# Altium schematic sheet SkayboardRev2.SchDoc
size A0
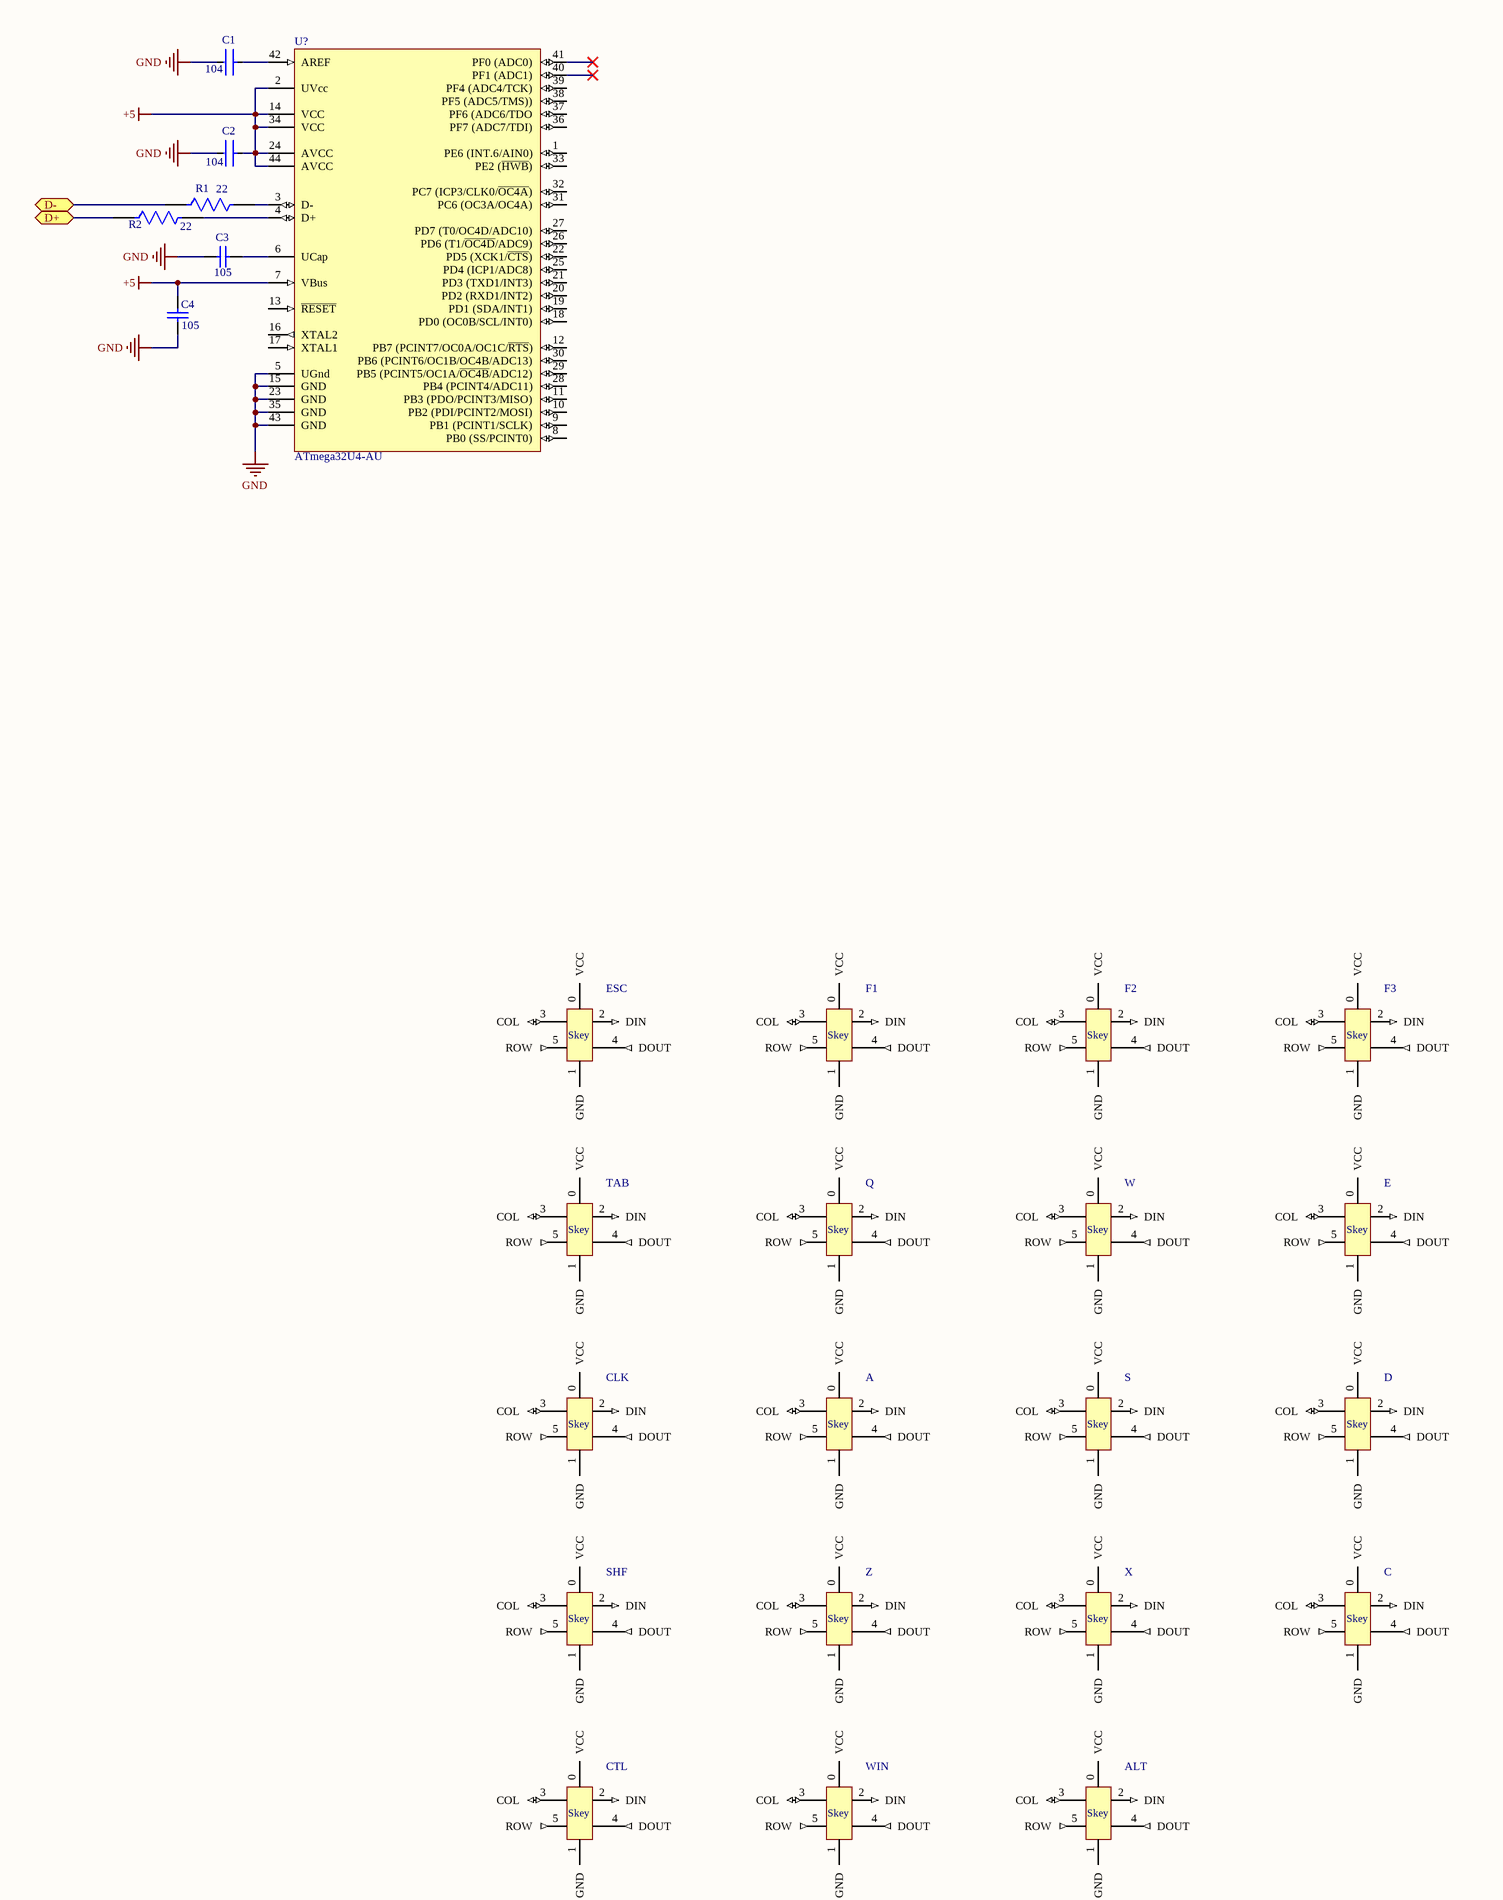
[diagram p0: SkayboardRev2.SchDoc, left]
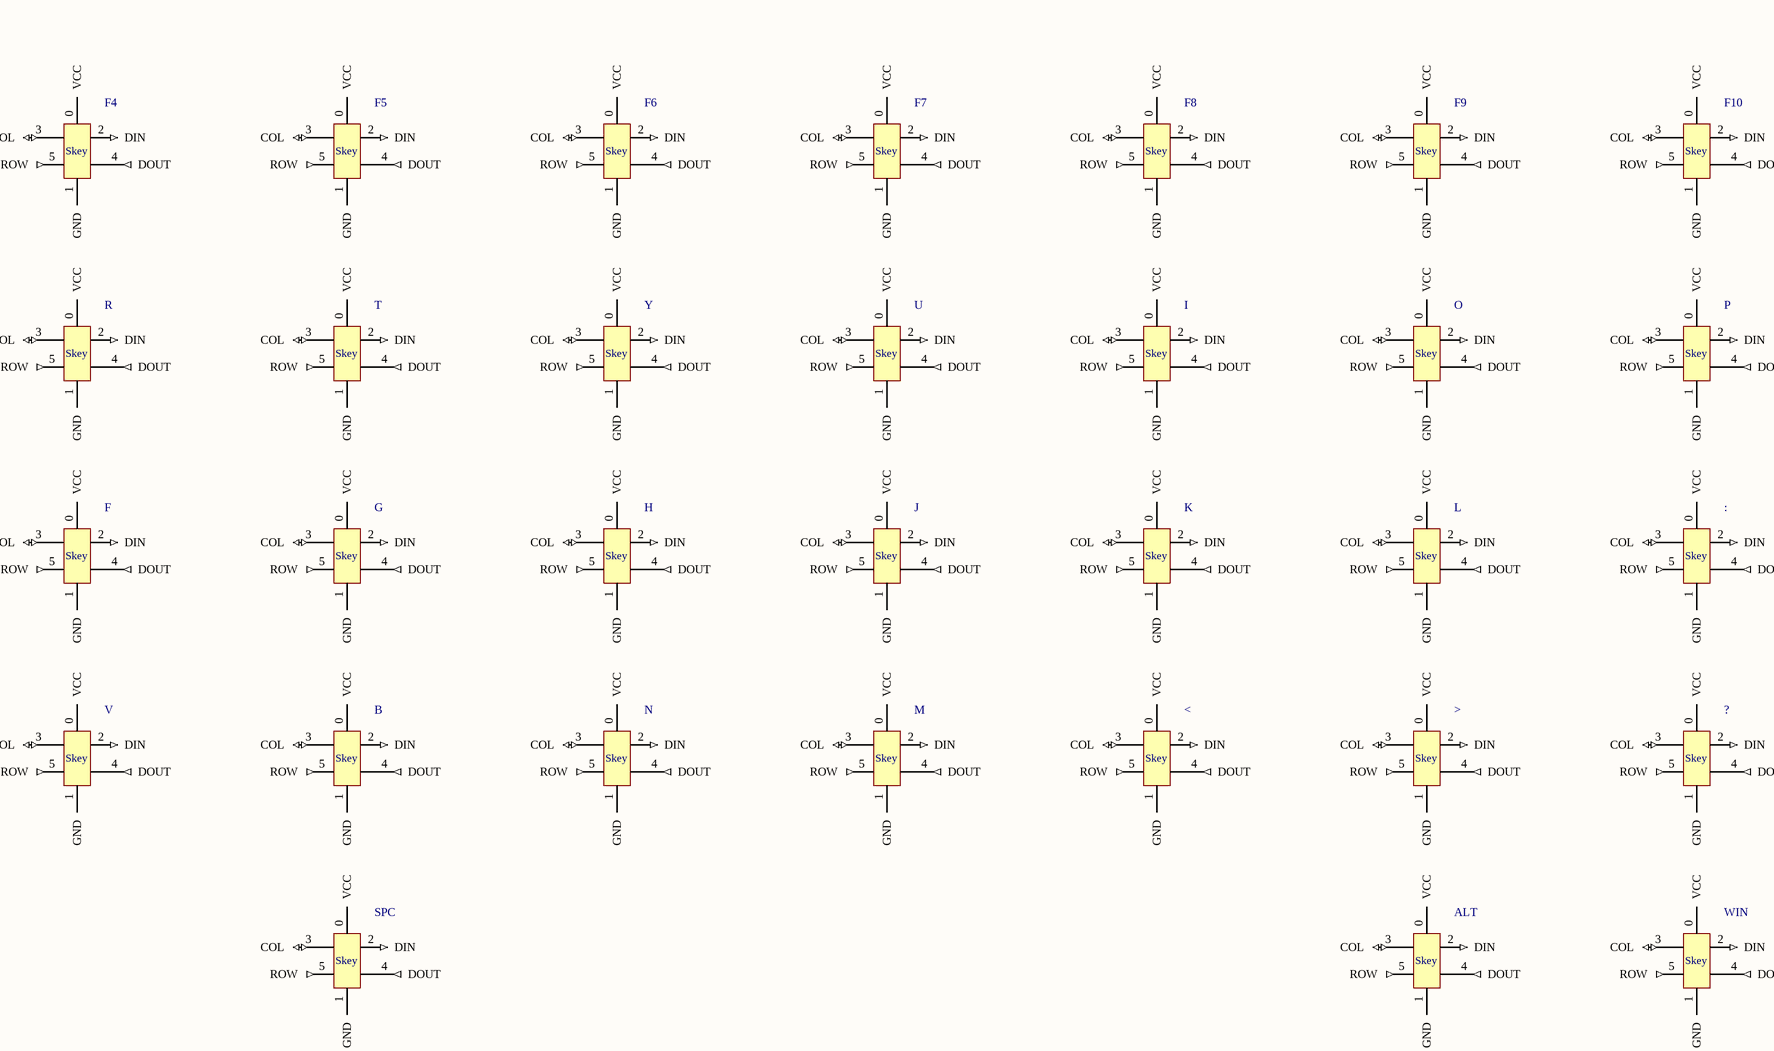
[diagram p1: SkayboardRev2.SchDoc, middle]
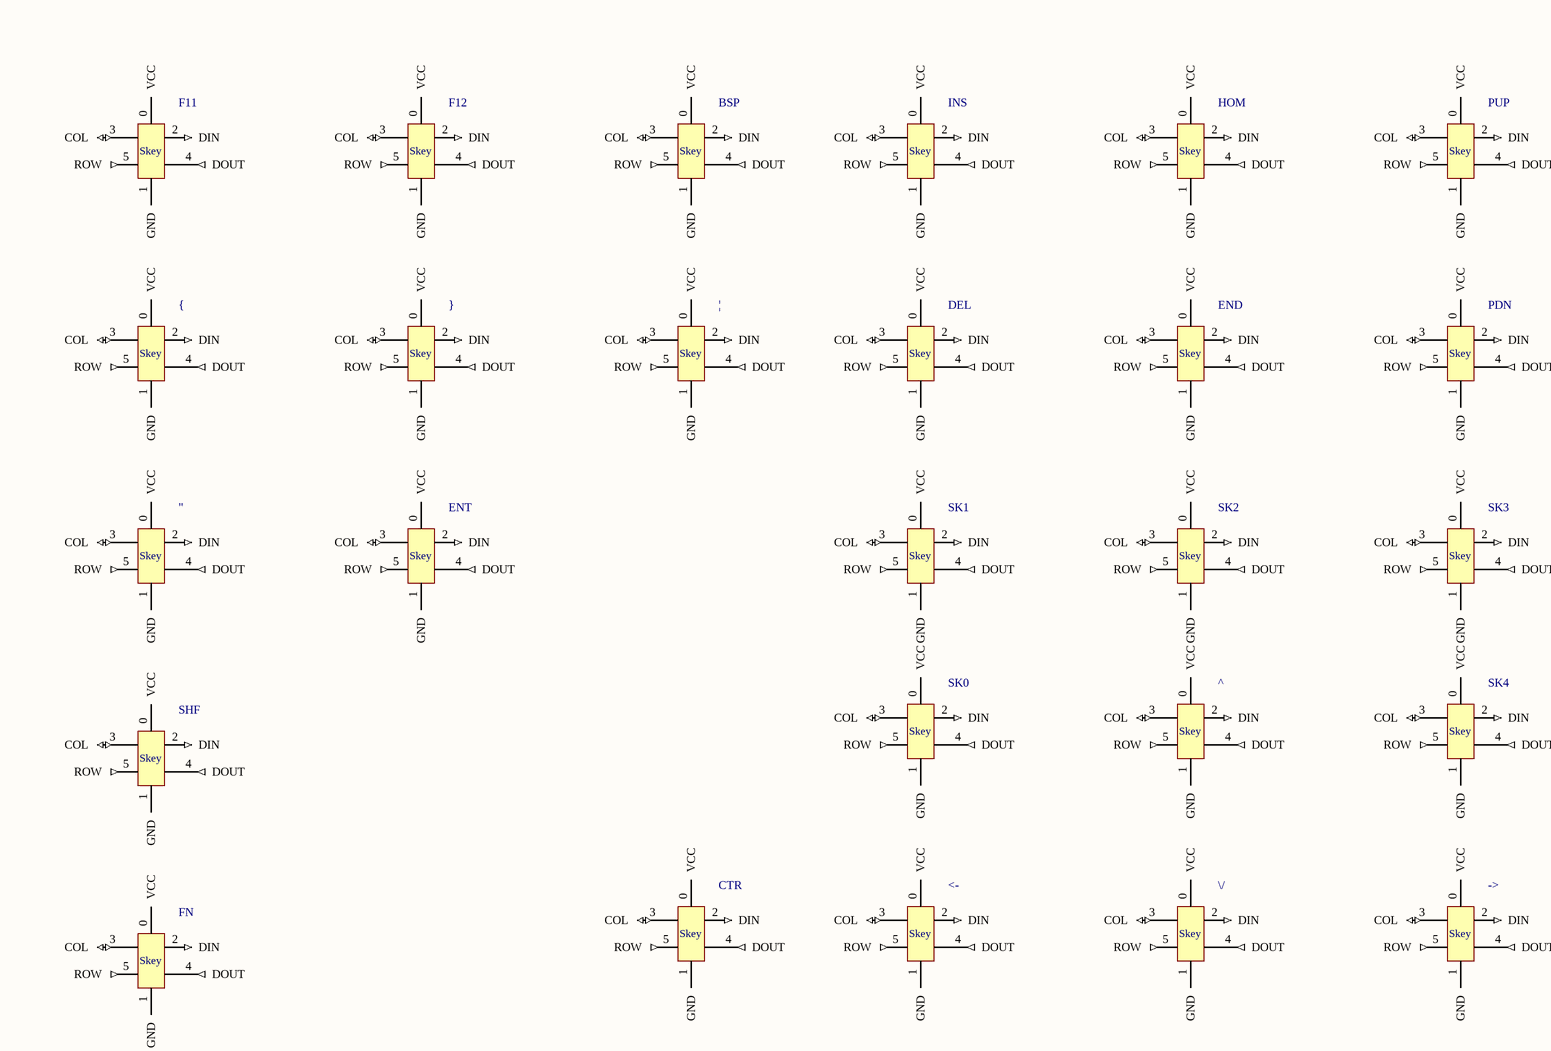
[diagram p2: SkayboardRev2.SchDoc, right]

## Parts
(Parts that share a designator on the sheet are numbered #1, #2 ... from top to bottom, then left to right.)
"  Skey  (value not drawn)  (mechanical)
->  Skey  (value not drawn)  (mechanical)
:  Skey  (value not drawn)  (mechanical)
<  Skey  (value not drawn)  (mechanical)
<-  Skey  (value not drawn)  (mechanical)
>  Skey  (value not drawn)  (mechanical)
?  Skey  (value not drawn)  (mechanical)
\/  Skey  (value not drawn)  (mechanical)
^  Skey  (value not drawn)  (mechanical)
A  Skey  (value not drawn)  (mechanical)
ALT#1  Skey  (value not drawn)  (mechanical)
ALT#2  Skey  (value not drawn)  (mechanical)
B  Skey  (value not drawn)  (mechanical)
BSP  Skey  (value not drawn)  (mechanical)
C  Skey  (value not drawn)  (mechanical)
C1  104  [FP-CGA3E-0_3-0_1-IPC_C]
C2  104  [FP-CGA3E-0_3-0_1-IPC_C]
C3  105  [CAPC1608X90X35LL10T15]
C4  105  [CAPC1608X90X35LL10T15]
CLK  Skey  (value not drawn)  (mechanical)
CTL  Skey  (value not drawn)  (mechanical)
CTR  Skey  (value not drawn)  (mechanical)
D  Skey  (value not drawn)  (mechanical)
DEL  Skey  (value not drawn)  (mechanical)
E  Skey  (value not drawn)  (mechanical)
END  Skey  (value not drawn)  (mechanical)
ENT  Skey  (value not drawn)  (mechanical)
ESC  Skey  (value not drawn)  (mechanical)
F  Skey  (value not drawn)  (mechanical)
F1  Skey  (value not drawn)  (mechanical)
F2  Skey  (value not drawn)  (mechanical)
F3  Skey  (value not drawn)  (mechanical)
F4  Skey  (value not drawn)  (mechanical)
F5  Skey  (value not drawn)  (mechanical)
F6  Skey  (value not drawn)  (mechanical)
F7  Skey  (value not drawn)  (mechanical)
F8  Skey  (value not drawn)  (mechanical)
F9  Skey  (value not drawn)  (mechanical)
F10  Skey  (value not drawn)  (mechanical)
F11  Skey  (value not drawn)  (mechanical)
F12  Skey  (value not drawn)  (mechanical)
FN  Skey  (value not drawn)  (mechanical)
G  Skey  (value not drawn)  (mechanical)
H  Skey  (value not drawn)  (mechanical)
HOM  Skey  (value not drawn)  (mechanical)
I  Skey  (value not drawn)  (mechanical)
INS  Skey  (value not drawn)  (mechanical)
J  Skey  (value not drawn)  (mechanical)
K  Skey  (value not drawn)  (mechanical)
L  Skey  (value not drawn)  (mechanical)
M  Skey  (value not drawn)  (mechanical)
N  Skey  (value not drawn)  (mechanical)
O  Skey  (value not drawn)  (mechanical)
P  Skey  (value not drawn)  (mechanical)
PDN  Skey  (value not drawn)  (mechanical)
PUP  Skey  (value not drawn)  (mechanical)
Q  Skey  (value not drawn)  (mechanical)
R  Skey  (value not drawn)  (mechanical)
R1  22  [FP-CRCW0603-HPe3-IPC_A]
R2  22  [FP-CRCW0603-HPe3-IPC_A]
S  Skey  (value not drawn)  (mechanical)
SHF#1  Skey  (value not drawn)  (mechanical)
SHF#2  Skey  (value not drawn)  (mechanical)
SK0  Skey  (value not drawn)  (mechanical)
SK1  Skey  (value not drawn)  (mechanical)
SK2  Skey  (value not drawn)  (mechanical)
SK3  Skey  (value not drawn)  (mechanical)
SK4  Skey  (value not drawn)  (mechanical)
SPC  Skey  (value not drawn)  (mechanical)
T  Skey  (value not drawn)  (mechanical)
TAB  Skey  (value not drawn)  (mechanical)
U  Skey  (value not drawn)  (mechanical)
U?  ATmega32U4-AU  [44ML_M]
V  Skey  (value not drawn)  (mechanical)
W  Skey  (value not drawn)  (mechanical)
WIN#1  Skey  (value not drawn)  (mechanical)
WIN#2  Skey  (value not drawn)  (mechanical)
X  Skey  (value not drawn)  (mechanical)
Y  Skey  (value not drawn)  (mechanical)
Z  Skey  (value not drawn)  (mechanical)
{  Skey  (value not drawn)  (mechanical)
}  Skey  (value not drawn)  (mechanical)
|  Skey  (value not drawn)  (mechanical)

## Ports
D+ (bidir), D- (bidir)

## Nets
+5: C2.1 C4.2 U?.2(UVcc) U?.7(VBus) U?.14(VCC) U?.24(AVCC) U?.34(VCC) U?.44(AVCC)
GND: C1.2 C2.2 C3.1 C4.1 U?.5(UGnd) U?.15(GND) U?.23(GND) U?.35(GND) U?.43(GND)
D+: R2.1 ; port D+
D-: R1.1 ; port D-
NetC1_1: C1.1 U?.42(AREF)
NetC3_2: C3.2 U?.6(UCap)
NetR1_2: R1.2 U?.3(D-)
NetR2_2: R2.2 U?.4(D+)

Not connected (* = marked no-connect by the designer): " 0(VCC) 1(GND) 2(DIN) 3(COL) 4(DOUT) 5(ROW); -> 0(VCC) 1(GND) 2(DIN) 3(COL) 4(DOUT) 5(ROW); : 0(VCC) 1(GND) 2(DIN) 3(COL) 4(DOUT) 5(ROW); < 0(VCC) 1(GND) 2(DIN) 3(COL) 4(DOUT) 5(ROW); <- 0(VCC) 1(GND) 2(DIN) 3(COL) 4(DOUT) 5(ROW); > 0(VCC) 1(GND) 2(DIN) 3(COL) 4(DOUT) 5(ROW); ? 0(VCC) 1(GND) 2(DIN) 3(COL) 4(DOUT) 5(ROW); \/ 0(VCC) 1(GND) 2(DIN) 3(COL) 4(DOUT) 5(ROW); ^ 0(VCC) 1(GND) 2(DIN) 3(COL) 4(DOUT) 5(ROW); A 0(VCC) 1(GND) 2(DIN) 3(COL) 4(DOUT) 5(ROW); ALT#1 0(VCC) 1(GND) 2(DIN) 3(COL) 4(DOUT) 5(ROW); ALT#2 0(VCC) 1(GND) 2(DIN) 3(COL) 4(DOUT) 5(ROW); B 0(VCC) 1(GND) 2(DIN) 3(COL) 4(DOUT) 5(ROW); BSP 0(VCC) 1(GND) 2(DIN) 3(COL) 4(DOUT) 5(ROW); C 0(VCC) 1(GND) 2(DIN) 3(COL) 4(DOUT) 5(ROW); CLK 0(VCC) 1(GND) 2(DIN) 3(COL) 4(DOUT) 5(ROW); CTL 0(VCC) 1(GND) 2(DIN) 3(COL) 4(DOUT) 5(ROW); CTR 0(VCC) 1(GND) 2(DIN) 3(COL) 4(DOUT) 5(ROW); D 0(VCC) 1(GND) 2(DIN) 3(COL) 4(DOUT) 5(ROW); DEL 0(VCC) 1(GND) 2(DIN) 3(COL) 4(DOUT) 5(ROW); E 0(VCC) 1(GND) 2(DIN) 3(COL) 4(DOUT) 5(ROW); END 0(VCC) 1(GND) 2(DIN) 3(COL) 4(DOUT) 5(ROW); ENT 0(VCC) 1(GND) 2(DIN) 3(COL) 4(DOUT) 5(ROW); ESC 0(VCC) 1(GND) 2(DIN) 3(COL) 4(DOUT) 5(ROW); F 0(VCC) 1(GND) 2(DIN) 3(COL) 4(DOUT) 5(ROW); F1 0(VCC) 1(GND) 2(DIN) 3(COL) 4(DOUT) 5(ROW); F2 0(VCC) 1(GND) 2(DIN) 3(COL) 4(DOUT) 5(ROW); F3 0(VCC) 1(GND) 2(DIN) 3(COL) 4(DOUT) 5(ROW); F4 0(VCC) 1(GND) 2(DIN) 3(COL) 4(DOUT) 5(ROW); F5 0(VCC) 1(GND) 2(DIN) 3(COL) 4(DOUT) 5(ROW); F6 0(VCC) 1(GND) 2(DIN) 3(COL) 4(DOUT) 5(ROW); F7 0(VCC) 1(GND) 2(DIN) 3(COL) 4(DOUT) 5(ROW); F8 0(VCC) 1(GND) 2(DIN) 3(COL) 4(DOUT) 5(ROW); F9 0(VCC) 1(GND) 2(DIN) 3(COL) 4(DOUT) 5(ROW); F10 0(VCC) 1(GND) 2(DIN) 3(COL) 4(DOUT) 5(ROW); F11 0(VCC) 1(GND) 2(DIN) 3(COL) 4(DOUT) 5(ROW); F12 0(VCC) 1(GND) 2(DIN) 3(COL) 4(DOUT) 5(ROW); FN 0(VCC) 1(GND) 2(DIN) 3(COL) 4(DOUT) 5(ROW); G 0(VCC) 1(GND) 2(DIN) 3(COL) 4(DOUT) 5(ROW); H 0(VCC) 1(GND) 2(DIN) 3(COL) 4(DOUT) 5(ROW); HOM 0(VCC) 1(GND) 2(DIN) 3(COL) 4(DOUT) 5(ROW); I 0(VCC) 1(GND) 2(DIN) 3(COL) 4(DOUT) 5(ROW); INS 0(VCC) 1(GND) 2(DIN) 3(COL) 4(DOUT) 5(ROW); J 0(VCC) 1(GND) 2(DIN) 3(COL) 4(DOUT) 5(ROW); K 0(VCC) 1(GND) 2(DIN) 3(COL) 4(DOUT) 5(ROW); L 0(VCC) 1(GND) 2(DIN) 3(COL) 4(DOUT) 5(ROW); M 0(VCC) 1(GND) 2(DIN) 3(COL) 4(DOUT) 5(ROW); N 0(VCC) 1(GND) 2(DIN) 3(COL) 4(DOUT) 5(ROW); O 0(VCC) 1(GND) 2(DIN) 3(COL) 4(DOUT) 5(ROW); P 0(VCC) 1(GND) 2(DIN) 3(COL) 4(DOUT) 5(ROW); PDN 0(VCC) 1(GND) 2(DIN) 3(COL) 4(DOUT) 5(ROW); PUP 0(VCC) 1(GND) 2(DIN) 3(COL) 4(DOUT) 5(ROW); Q 0(VCC) 1(GND) 2(DIN) 3(COL) 4(DOUT) 5(ROW); R 0(VCC) 1(GND) 2(DIN) 3(COL) 4(DOUT) 5(ROW); S 0(VCC) 1(GND) 2(DIN) 3(COL) 4(DOUT) 5(ROW); SHF#1 0(VCC) 1(GND) 2(DIN) 3(COL) 4(DOUT) 5(ROW); SHF#2 0(VCC) 1(GND) 2(DIN) 3(COL) 4(DOUT) 5(ROW); SK0 0(VCC) 1(GND) 2(DIN) 3(COL) 4(DOUT) 5(ROW); SK1 0(VCC) 1(GND) 2(DIN) 3(COL) 4(DOUT) 5(ROW); SK2 0(VCC) 1(GND) 2(DIN) 3(COL) 4(DOUT) 5(ROW); SK3 0(VCC) 1(GND) 2(DIN) 3(COL) 4(DOUT) 5(ROW); SK4 0(VCC) 1(GND) 2(DIN) 3(COL) 4(DOUT) 5(ROW); SPC 0(VCC) 1(GND) 2(DIN) 3(COL) 4(DOUT) 5(ROW); T 0(VCC) 1(GND) 2(DIN) 3(COL) 4(DOUT) 5(ROW); TAB 0(VCC) 1(GND) 2(DIN) 3(COL) 4(DOUT) 5(ROW); U 0(VCC) 1(GND) 2(DIN) 3(COL) 4(DOUT) 5(ROW); U? 1(PE6_(INT.6/AIN0)) 8(PB0_(SS/PCINT0)) 9(PB1_(PCINT1/SCLK)) 10(PB2_(PDI/PCINT2/MOSI)) 11(PB3_(PDO/PCINT3/MISO)) 12(PB7_(PCINT7/OC0A/OC1C/~{RTS})) 13(~{RESET}) 16(XTAL2) 17(XTAL1) 18(PD0_(OC0B/SCL/INT0)) 19(PD1_(SDA/INT1)) 20(PD2_(RXD1/INT2)) 21(PD3_(TXD1/INT3)) 22(PD5_(XCK1/~{CTS})) 25(PD4_(ICP1/ADC8)) 26(PD6_(T1/~{OC4D}/ADC9)) 27(PD7_(T0/OC4D/ADC10)) 28(PB4_(PCINT4/ADC11)) 29(PB5_(PCINT5/OC1A/~{OC4B}/ADC12)) 30(PB6_(PCINT6/OC1B/OC4B/ADC13)) 31(PC6_(OC3A/OC4A)) 32(PC7_(ICP3/CLK0/~{OC4A})) 33(PE2_(~{HWB})) 36(PF7_(ADC7/TDI)) 37(PF6_(ADC6/TDO) 38(PF5_(ADC5/TMS))) 39(PF4_(ADC4/TCK)) 40(PF1_(ADC1))* 41(PF0_(ADC0))*; V 0(VCC) 1(GND) 2(DIN) 3(COL) 4(DOUT) 5(ROW); W 0(VCC) 1(GND) 2(DIN) 3(COL) 4(DOUT) 5(ROW); WIN#1 0(VCC) 1(GND) 2(DIN) 3(COL) 4(DOUT) 5(ROW); WIN#2 0(VCC) 1(GND) 2(DIN) 3(COL) 4(DOUT) 5(ROW); X 0(VCC) 1(GND) 2(DIN) 3(COL) 4(DOUT) 5(ROW); Y 0(VCC) 1(GND) 2(DIN) 3(COL) 4(DOUT) 5(ROW); Z 0(VCC) 1(GND) 2(DIN) 3(COL) 4(DOUT) 5(ROW); { 0(VCC) 1(GND) 2(DIN) 3(COL) 4(DOUT) 5(ROW); } 0(VCC) 1(GND) 2(DIN) 3(COL) 4(DOUT) 5(ROW); | 0(VCC) 1(GND) 2(DIN) 3(COL) 4(DOUT) 5(ROW)

## Notes on the sheet
- Title
- Size:
- Date:
- File:
- A0
- Number:
- Time:
- Revision:
- Sheet
- of

## Library data of the parts
" -> : < <- > ? \/ ^ A ALT#1 ALT#2 B BSP C CLK CTL CTR D DEL E END ENT ESC F F1-F12 FN G H HOM I INS J K L M N O P PDN PUP Q R S SHF#1 SHF#2 SK0-SK4 SPC T TAB U V W WIN#1 WIN#2 X Y Z { } | = Skey: Skey's Symbol
C1 C2 = CMP-08246-000204-1: Cap Ceramic 2.2nF 100V X7R 10% Pad SMD 0603 +125°C Automotive T/R; Termination: SMD/SMT; Min Operating Temperature: -55°C; Lead Free: Lead Free; Composition: Ceramic; Voltage Rating (DC): 100V; Case/Package: 0603; Package Quantity: 4000; Case Code (Imperial): 0603; Ratings: AEC-Q200; Voltage Rating: 100V; REACH SVHC: No SVHC; Dielectric: X7R; Depth: 0.8mm; Weight: 7.1E-05oz; Packaging: Tape and Reel; Tolerance: 10%; Height: 0.8mm; Case Code (Metric): 1608; Capacitance: 2.2nF; Mount: Surface Mount; Max Operating Temperature: 125°C; Length: 1.6mm; Width: 0.8mm; Thickness: 0.035inch
C3 C4 = CMP-2006-02459-1: Manufacturer: Murata; Part Number: GRM188R61E105KA12D
R1 R2 = CMP-02407-008302-1: RES Thick Film, 22Ω, 5%, 0.33W, 200ppm/°C, 0603; Voltage Rating: 75V; Power Rating: 250mW; Resistance: 22R; Min Operating Temperature: -55°C; Weight: 7.1E-05oz; Max Operating Temperature: 155°C; Contact Plating: Tin; Tolerance: 5%; Package Quantity: 5000; Length: 1.6mm; Case Code (Imperial): 0603; Radiation Hardening: No; Lead Free: Lead Free; Case/Package: 0603; Mount: Surface Mount; Depth: 0.85mm; Height: 0.45mm; Military Standard: Not; Temperature Coefficient: 200ppm/°C; Packaging: Tape and Reel; Case Code (Metric): 1608; Composition: Thick Film; Width: 0.8mm
U? = CMP-0095-00285-2: 8-bit AVR Microcontroller, 2.7-5.5V, 16MHz, 32KB Flash, 1KB EEPROM, 2.5KB SRAM, USB Controller, 44-pin TQFP, Industrial Grade (-40°C to 85°C), Ext Osc; RevisionNote: DatasheetVersion updated. URLs added.; ComponentLink1Description: Manufacturer URL; PackageDescription: 44-Pin Plastic Thin Quad Flat Pack, 10 x 10 x 1.0 mm Body, 0.8 mm Pitch (TQFP); DatasheetVersion: revF, Nov-2010; ComponentLink2URL: http://www.atmel.com/dyn/resources/prod_documents/doc7766.pdf; ComponentLink1URL: http://www.atmel.com/; PackageReference: 44ML; ComponentLink2Description: ATmega16U4/32U4 Datasheet; PackageVersion: rev.G, Jul-2007; ComponentLink3URL: http://www.atmel.com/dyn/resources/prod_documents/7766S.pdf; ComponentLink3Description: ATmega16U4 ATmega32U4 Summary